# EAGLE schematic Tugas1 (EAGLE 7.6.0)
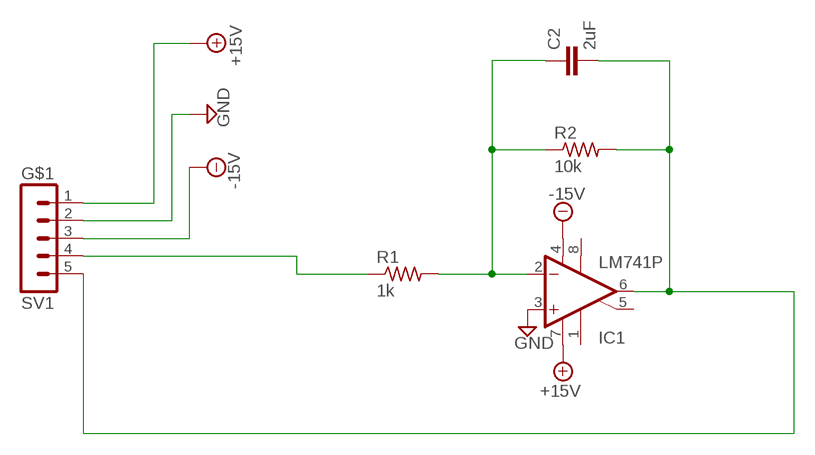
[diagram p0: schematic, sheet 1]

## Parts
C2  2uF  C-EUC0603  [C0603]
IC1  LM741P  [DIL08]
R1  1k  R-US_R0603  [R0603]
R2  10k  R-US_R0603  [R0603]
SV1  G$1  MA05-1  [MA05-1]

## Nets
+15V: IC1.7(V+) SV1.1
-15V: IC1.4(V-) SV1.3
GND: IC1.3(+IN) SV1.2
N$1: C2.2 IC1.6(OUT) R2.2 SV1.5
N$2: C2.1 IC1.2(-IN) R1.2 R2.1
N$3: R1.1 SV1.4
Unconnected: IC1.1(ON1) IC1.5(ON2) IC1.8(OPT)

## Library data of the parts
C2 = rcl:C-EU: CAPACITOR, European symbol
IC1 = linear:*741: OP AMP
R1 R2 = rcl:R-US_: RESISTOR, American symbol
SV1 = con-lstb:MA05-1: PIN HEADER; OC_FARNELL: unknown; OC_NEWARK: unknown